# Altium project Ultrasonic.PrjPcb
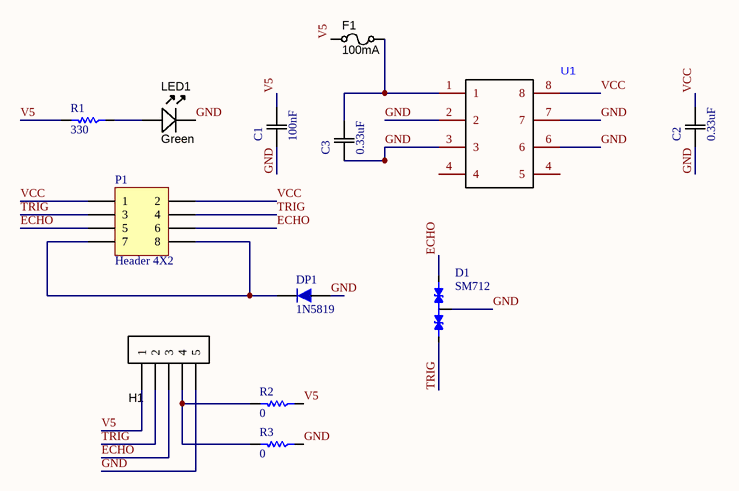
[diagram p0: Ultarsonic_Bourd.SchDoc]
1 sheet, 13 parts. Net scope: global (net labels, ports and power ports of the same name join across sheets).
Board files: Ultrasonic___PCB.PcbDoc, Ultrasonic___Sheet.PcbDoc

## Sheet Ultarsonic_Bourd.SchDoc
size B

### Parts
C1  100nF  [0805]
C2  0.33uF  [0805]
C3  0.33uF  [0805]
D1  SM712  [psm712]
DP1  1N5819  [430X270D]
F1  value 100mA  [RESC3216X70N]  (hidden comment: Slow-blow)
H1  Programmer  [HDR1X5_2.54MMP]  (value not drawn)  (no BOM)
LED1  Color: Green  [LED-0805-K]
P1  Header 4X2  [HDR2X4]
R1  330  [RES 0805 (2012X06L)]
R2  0  [RES 0805 (2012X06L)]
R3  0  [RES 0805 (2012X06L)]
U1  (no value)  [78L05CD15V5V_LIB]

### Nets
ECHO: D1.1 H1.3 P1.5 P1.6
GND: C1.1(C1) C2.1(C1) C3.1(C1) D1.3 DP1.1 H1.5 LED1.K R3.1 U1.2 U1.3 U1.6 U1.7
TRIG: D1.2 H1.2 P1.3 P1.4
V5: C1.2(C2) F1.2 H1.1 R1.2 R2.1
VCC: C2.2(C2) P1.1 P1.2 U1.8
NetC3_2: C3.2(C2) F1.1 U1.1
NetDP1_2: DP1.2 P1.7 P1.8
NetH1_4: H1.4 R2.2 R3.2
NetLED1_A: LED1.A R1.1

Not connected (* = marked no-connect by the designer): U1 4

### Library data of the parts
C1-C3 = CAP 470nF 50V: CAP CER 0.1UF 50V X7R 0805; Value: 470nF; Tolerance: 10%; Package: 0805; Rating: 50V
D1 = SM712.TC: Asymmetrical TVS Diode for  Extended Common-Mode RS-485; Manufacturer: SEMTECH; Link to Datasheet: *; Link to Picture: *; Operating Temp: -55 to 125 °C; Storage Temp: -55 to 150 °C; ComponentLink1Description: *; ComponentLink1URL: *; Manufacture Part #: SM712.TC; Value: SM712
DP1 = 1N5819: Schottkey Rectifiers; Designer: Abbas Basereh; Data: 16-12-2016; Link: *; Part. No: *
F1 = FUSE_160mA_1206: Fuse 160mA 63VDC 1206 SMD; Manufacturer 1: Holly Fuse; Manufacturer Part Number 1: 12T-0160L; Ratings: 160mA; 63VDC; slow-blow; SCDType: spec; Package / Case: 1206 (3216 metric)
H1 = Header5P: Header 5-pin
LED1 = LED_SMD_Green_0805_6mcd: LED, 0805 SMD, Green; Manufacturer 1: LITE-ON; Manufacturer Part Number 1: LTST-C171GKT; Material: GaP; Ratings: 6 mcd; 569 nm; SCDType: source; Package / Case: 0805; Supplier 1: Digi-Key; Supplier Part Number 1: 160-1423-1-ND; Value: Green
P1 = Header 4X2: Header, 4-Pin, Dual row; LatestRevisionDate: 17-Jul-2002; LatestRevisionNote: Re-released for DXP Platform.; Publisher: Altium Limited
R1-R3 = Resistor: Tolerance: 5%; Power: 1/8 W
  R1: Value: 330
  R2 R3: Value: 0
U1 = MC78L05ACDG 5V Regulator